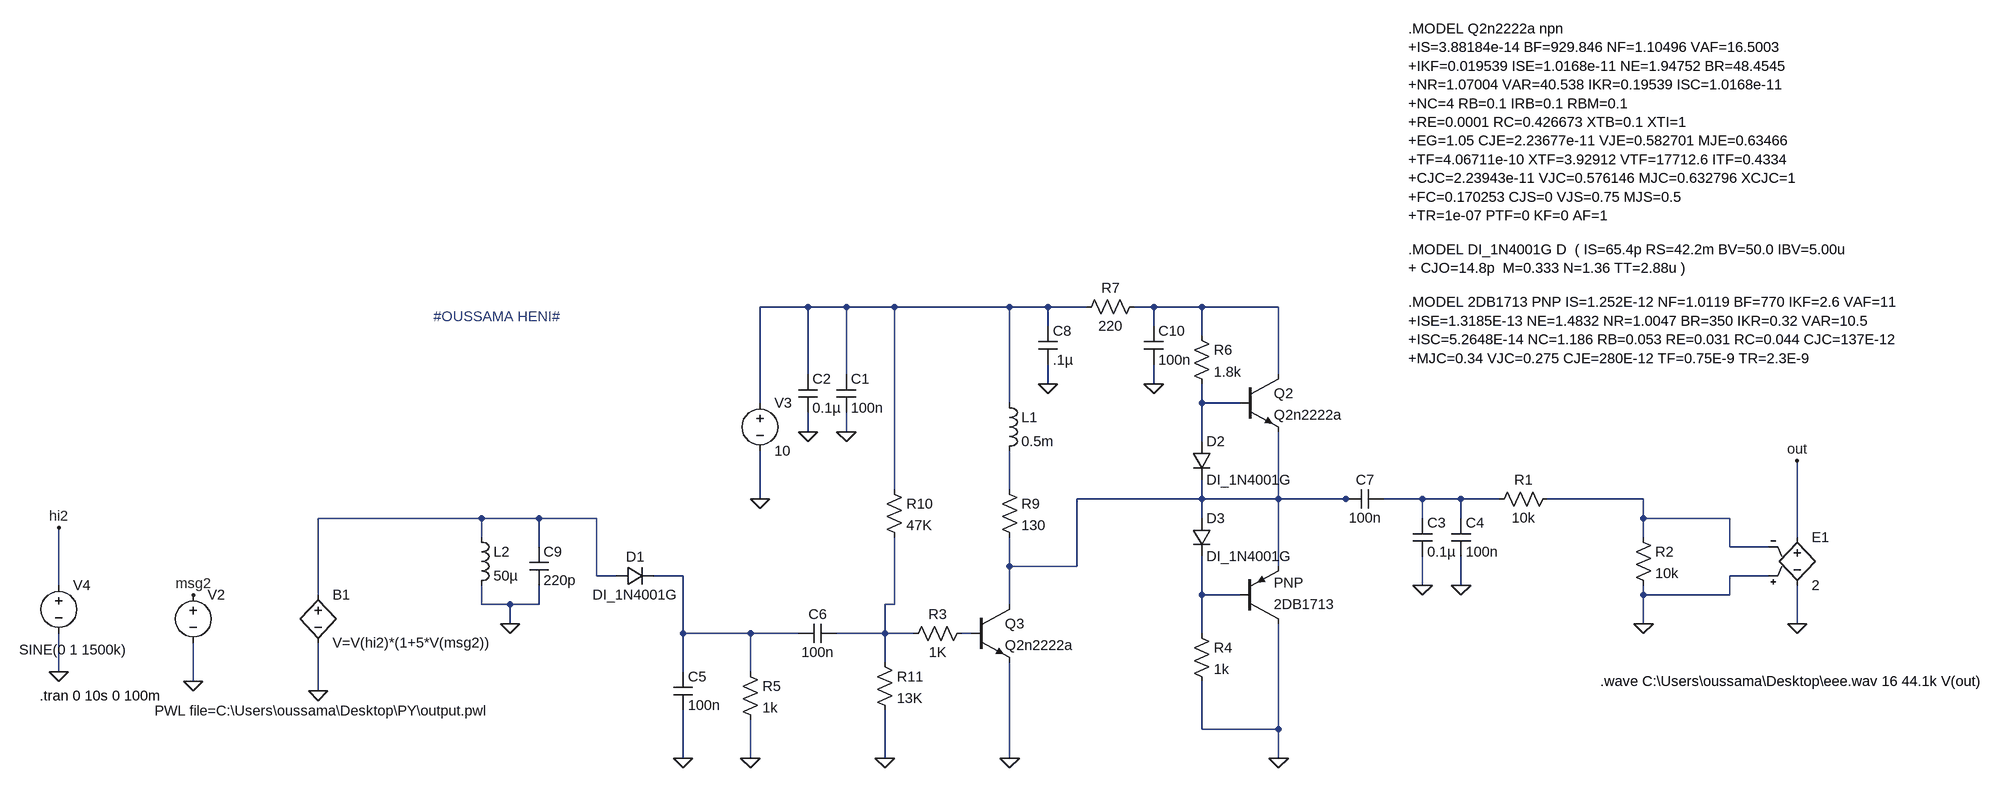
[diagram p0: schematic Draft2.asc]
Draft2.asc, the LTspice schematic file:
Version 4.1
SHEET 1 2600 1316
WIRE -96 -464 -176 -464
WIRE -32 -464 -96 -464
WIRE 48 -464 -32 -464
WIRE 240 -464 48 -464
WIRE 304 -464 240 -464
WIRE 368 -464 304 -464
WIRE 480 -464 448 -464
WIRE 560 -464 480 -464
WIRE 688 -464 560 -464
WIRE 304 -432 304 -464
WIRE 480 -432 480 -464
WIRE 560 -416 560 -464
WIRE -96 -352 -96 -464
WIRE -32 -352 -32 -464
WIRE 688 -352 688 -464
WIRE 304 -336 304 -368
WIRE 480 -336 480 -368
WIRE -176 -304 -176 -464
WIRE 240 -304 240 -464
WIRE 560 -304 560 -336
WIRE 624 -304 560 -304
WIRE -96 -256 -96 -288
WIRE -32 -256 -32 -288
WIRE 560 -240 560 -304
WIRE 48 -160 48 -464
WIRE 240 -160 240 -224
WIRE -176 -144 -176 -224
WIRE 560 -144 560 -176
WIRE 560 -144 352 -144
WIRE 688 -144 688 -256
WIRE 688 -144 560 -144
WIRE 800 -144 688 -144
WIRE 816 -144 800 -144
WIRE 928 -144 864 -144
WIRE 992 -144 928 -144
WIRE 1056 -144 992 -144
WIRE 1296 -144 1136 -144
WIRE -640 -112 -912 -112
WIRE -544 -112 -640 -112
WIRE -448 -112 -544 -112
WIRE 560 -112 560 -144
WIRE 928 -112 928 -144
WIRE 992 -112 992 -144
WIRE 1296 -112 1296 -144
WIRE 1440 -112 1296 -112
WIRE -640 -80 -640 -112
WIRE 1296 -80 1296 -112
WIRE 1552 -80 1552 -208
WIRE -544 -64 -544 -112
WIRE 1440 -64 1440 -112
WIRE 1504 -64 1440 -64
WIRE 240 -32 240 -80
WIRE 352 -32 352 -144
WIRE 352 -32 240 -32
WIRE 688 -32 688 -144
WIRE -448 -16 -448 -112
WIRE -416 -16 -448 -16
WIRE -304 -16 -352 -16
WIRE 1504 -16 1440 -16
WIRE -1344 0 -1344 -96
WIRE 928 0 928 -48
WIRE 992 0 992 -48
WIRE -912 16 -912 -112
WIRE 560 16 560 -48
WIRE 624 16 560 16
WIRE 1296 16 1296 0
WIRE 1440 16 1440 -16
WIRE 1440 16 1296 16
WIRE -640 32 -640 0
WIRE -592 32 -640 32
WIRE -544 32 -544 0
WIRE -544 32 -592 32
WIRE 48 32 48 -80
WIRE 48 32 32 32
WIRE 240 32 240 -32
WIRE -592 64 -592 32
WIRE 1296 64 1296 16
WIRE 1552 64 1552 0
WIRE -304 80 -304 -16
WIRE -192 80 -304 80
WIRE -112 80 -192 80
WIRE 32 80 32 32
WIRE 32 80 -48 80
WIRE 80 80 32 80
WIRE 176 80 160 80
WIRE 560 80 560 16
WIRE 32 128 32 80
WIRE -1344 144 -1344 80
WIRE -304 144 -304 80
WIRE -192 144 -192 80
WIRE -1120 160 -1120 96
WIRE -912 176 -912 96
WIRE 560 240 560 160
WIRE 688 240 688 64
WIRE 688 240 560 240
WIRE -304 288 -304 208
WIRE -192 288 -192 224
WIRE 32 288 32 208
WIRE 240 288 240 128
WIRE 688 288 688 240
FLAG 1296 64 0
FLAG 1552 64 0
FLAG 1552 -208 out
FLAG -176 -144 0
FLAG -32 -256 0
FLAG -96 -256 0
FLAG 928 0 0
FLAG 992 0 0
FLAG -304 288 0
FLAG -1120 160 0
FLAG -1120 16 msg2
FLAG -1344 144 0
FLAG -912 176 0
FLAG -1344 -96 hi2
FLAG -592 64 0
FLAG 688 288 0
FLAG 32 288 0
FLAG 304 -336 0
FLAG 480 -336 0
FLAG 240 288 0
FLAG -192 288 0
SYMBOL res 1152 -160 R90
WINDOW 0 0 56 VBottom 2
WINDOW 3 32 56 VTop 2
SYMATTR InstName R1
SYMATTR Value 10k
SYMBOL res 1280 -96 R0
SYMATTR InstName R2
SYMATTR Value 10k
SYMBOL e2 1552 -96 R0
SYMATTR InstName E1
SYMATTR Value 2
SYMBOL npn 176 32 R0
SYMATTR InstName Q3
SYMATTR Value Q2n2222a
SYMBOL voltage -176 -320 R0
WINDOW 123 0 0 Left 0
WINDOW 39 0 0 Left 0
SYMATTR InstName V3
SYMATTR Value 10
SYMBOL res 224 -176 R0
SYMATTR InstName R9
SYMATTR Value 130
SYMBOL ind 224 -320 R0
SYMATTR InstName L1
SYMATTR Value 0.5m
SYMBOL res 32 -176 R0
SYMATTR InstName R10
SYMATTR Value 47K
SYMBOL res 16 112 R0
SYMATTR InstName R11
SYMATTR Value 13K
SYMBOL cap -48 64 R90
WINDOW 0 0 32 VBottom 2
WINDOW 3 32 32 VTop 2
SYMATTR InstName C6
SYMATTR Value 100n
SYMBOL cap 864 -160 R90
WINDOW 0 0 32 VBottom 2
WINDOW 3 32 32 VTop 2
SYMATTR InstName C7
SYMATTR Value 100n
SYMBOL cap -48 -352 R0
SYMATTR InstName C1
SYMATTR Value 100n
SYMBOL cap -112 -352 R0
SYMATTR InstName C2
SYMATTR Value 0.1µ
SYMBOL cap 912 -112 R0
SYMATTR InstName C3
SYMATTR Value 0.1µ
SYMBOL cap 976 -112 R0
SYMATTR InstName C4
SYMATTR Value 100n
SYMBOL res 176 64 R90
WINDOW 0 0 56 VBottom 2
WINDOW 3 32 56 VTop 2
SYMATTR InstName R3
SYMATTR Value 1K
SYMBOL cap -320 144 R0
SYMATTR InstName C5
SYMATTR Value 100n
SYMBOL voltage -1120 0 R0
WINDOW 3 -64 209 Left 2
WINDOW 123 0 0 Left 0
WINDOW 39 0 0 Left 0
SYMATTR Value PWL file=C:\Users\oussama\Desktop\PY\output.pwl
SYMATTR InstName V2
SYMBOL bv -912 0 R0
SYMATTR InstName B1
SYMATTR Value V=V(hi2)*(1+5*V(msg2))
SYMBOL voltage -1344 -16 R0
WINDOW 123 0 0 Left 0
WINDOW 39 0 0 Left 0
WINDOW 3 -66 123 Left 2
SYMATTR Value SINE(0 1 1500k)
SYMATTR InstName V4
SYMBOL diode -416 0 R270
WINDOW 0 32 32 VTop 2
WINDOW 3 0 32 VBottom 2
SYMATTR InstName D1
SYMATTR Value DI_1N4001G
SYMBOL cap -560 -64 R0
SYMATTR InstName C9
SYMATTR Value 220p
SYMBOL ind -656 -96 R0
SYMATTR InstName L2
SYMATTR Value 50µ
SYMBOL pnp 624 64 M180
SYMATTR InstName 2DB1713
SYMBOL npn 624 -352 R0
SYMATTR InstName Q2
SYMATTR Value Q2n2222a
SYMBOL diode 544 -240 R0
SYMATTR InstName D2
SYMATTR Value DI_1N4001G
SYMBOL diode 544 -112 R0
SYMATTR InstName D3
SYMATTR Value DI_1N4001G
SYMBOL res 544 -432 R0
SYMATTR InstName R6
SYMATTR Value 1.8k
SYMBOL res 464 -480 R90
WINDOW 0 0 56 VBottom 2
WINDOW 3 32 56 VTop 2
SYMATTR InstName R7
SYMATTR Value 220
SYMBOL cap 288 -432 R0
SYMATTR InstName C8
SYMATTR Value .1µ
SYMBOL cap 464 -432 R0
SYMATTR InstName C10
SYMATTR Value 100n
SYMBOL res 544 64 R0
SYMATTR InstName R4
SYMATTR Value 1k
SYMBOL res -208 128 R0
SYMATTR InstName R5
SYMATTR Value 1k
TEXT 1224 160 Left 2 !.wave C:\\Users\\oussama\\Desktop\\eee.wav 16 44.1k V(out)
TEXT 904 -928 Left 2 !.MODEL Q2n2222a npn\n+IS=3.88184e-14 BF=929.846 NF=1.10496 VAF=16.5003\n+IKF=0.019539 ISE=1.0168e-11 NE=1.94752 BR=48.4545\n+NR=1.07004 VAR=40.538 IKR=0.19539 ISC=1.0168e-11\n+NC=4 RB=0.1 IRB=0.1 RBM=0.1\n+RE=0.0001 RC=0.426673 XTB=0.1 XTI=1\n+EG=1.05 CJE=2.23677e-11 VJE=0.582701 MJE=0.63466\n+TF=4.06711e-10 XTF=3.92912 VTF=17712.6 ITF=0.4334\n+CJC=2.23943e-11 VJC=0.576146 MJC=0.632796 XCJC=1\n+FC=0.170253 CJS=0 VJS=0.75 MJS=0.5\n+TR=1e-07 PTF=0 KF=0 AF=1
TEXT -1376 184 Left 2 !.tran 0 10s 0 100m
TEXT 904 -560 Left 2 !.MODEL DI_1N4001G D  ( IS=65.4p RS=42.2m BV=50.0 IBV=5.00u\n+ CJO=14.8p  M=0.333 N=1.36 TT=2.88u )
TEXT 904 -472 Left 2 !.MODEL 2DB1713 PNP IS=1.252E-12 NF=1.0119 BF=770 IKF=2.6 VAF=11\n+ISE=1.3185E-13 NE=1.4832 NR=1.0047 BR=350 IKR=0.32 VAR=10.5\n+ISC=5.2648E-14 NC=1.186 RB=0.053 RE=0.031 RC=0.044 CJC=137E-12\n+MJC=0.34 VJC=0.275 CJE=280E-12 TF=0.75E-9 TR=2.3E-9
TEXT -720 -448 Left 2 ;#OUSSAMA HENI#

The netlist it stands for:
* Draft2.asc
R1 N007 N006 10k
R2 N007 0 10k
E1 out 0 0 N007 2
Q3 N005 N012 0 0 Q2n2222a
V3 N001 0 10
R9 N004 N005 130
L1 N001 N004 0.5m
R10 N001 N011 47K
R11 N011 0 13K
C6 N011 N009 100n
C7 N006 N005 100n
C1 N001 0 100n
C2 N001 0 0.1µ
C3 N006 0 0.1µ
C4 N006 0 100n
R3 N012 N011 1K
C5 N009 0 100n
V2 msg2 0 PWL file=C:\Users\oussama\Desktop\PY\output.pwl
B1 N008 0 V=V(hi2)*(1+5*V(msg2))
V4 hi2 0 SINE(0 1 1500k)
D1 N008 N009 DI_1N4001G
C9 N008 0 220p
L2 N008 0 50µ
Q§2DB1713 0 N010 N005 0 PNP
Q2 N002 N003 N005 0 Q2n2222a
D2 N003 N005 DI_1N4001G
D3 N005 N010 DI_1N4001G
R6 N002 N003 1.8k
R7 N002 N001 220
C8 N001 0 .1µ
C10 N002 0 100n
R4 N010 0 1k
R5 N009 0 1k
.model D D
.lib standard.dio
.model NPN NPN
.model PNP PNP
.lib standard.bjt
.wave C:\Users\oussama\Desktop\eee.wav 16 44.1k V(out)
.MODEL Q2n2222a npn
+IS=3.88184e-14 BF=929.846 NF=1.10496 VAF=16.5003
+IKF=0.019539 ISE=1.0168e-11 NE=1.94752 BR=48.4545
+NR=1.07004 VAR=40.538 IKR=0.19539 ISC=1.0168e-11
+NC=4 RB=0.1 IRB=0.1 RBM=0.1
+RE=0.0001 RC=0.426673 XTB=0.1 XTI=1
+EG=1.05 CJE=2.23677e-11 VJE=0.582701 MJE=0.63466
+TF=4.06711e-10 XTF=3.92912 VTF=17712.6 ITF=0.4334
+CJC=2.23943e-11 VJC=0.576146 MJC=0.632796 XCJC=1
+FC=0.170253 CJS=0 VJS=0.75 MJS=0.5
+TR=1e-07 PTF=0 KF=0 AF=1
.tran 0 10s 0 100m
.MODEL DI_1N4001G D  ( IS=65.4p RS=42.2m BV=50.0 IBV=5.00u
+ CJO=14.8p  M=0.333 N=1.36 TT=2.88u )
.MODEL 2DB1713 PNP IS=1.252E-12 NF=1.0119 BF=770 IKF=2.6 VAF=11
+ISE=1.3185E-13 NE=1.4832 NR=1.0047 BR=350 IKR=0.32 VAR=10.5
+ISC=5.2648E-14 NC=1.186 RB=0.053 RE=0.031 RC=0.044 CJC=137E-12
+MJC=0.34 VJC=0.275 CJE=280E-12 TF=0.75E-9 TR=2.3E-9
* #OUSSAMA HENI#
.backanno
.end